# Altium project PH.PrjPcb
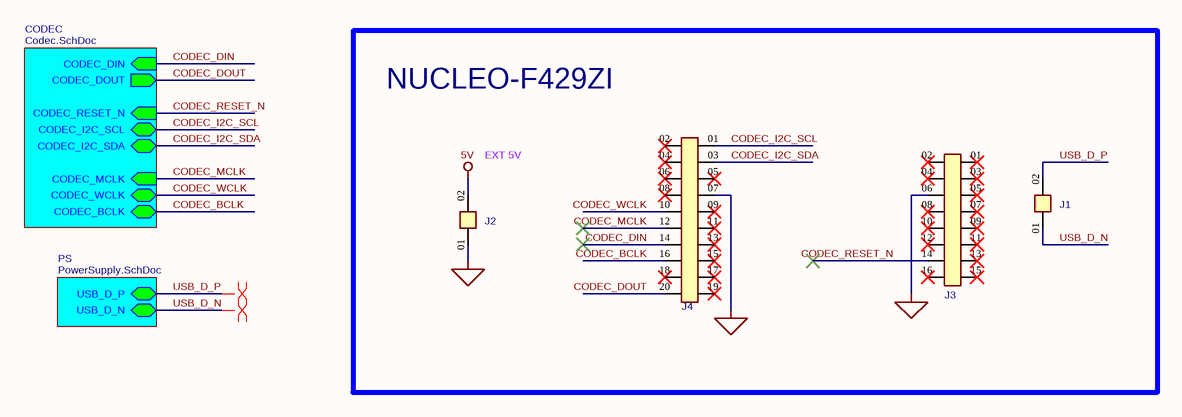
[diagram p0: AudioLab.SchDoc]
3 sheets, 115 parts. Net scope: hierarchical (ports join the sheet entries above them; power ports are global).
Board file: AudioLab.PcbDoc
Sheets:
  AudioLab.SchDoc
    CODEC = Codec.SchDoc
    PS = PowerSupply.SchDoc

## Sheet AudioLab.SchDoc: audiolab
size A3; Author: Martín Ramírez Espinosa; Revision: 1.0; SheetNumber: 1; SheetTotal: 3

### Parts
J1  HTSW-102-07-G-S  [SAMTEC_HTSW-102-XX-X-S]  (value not drawn)
J2  HTSW-102-07-G-S  [SAMTEC_HTSW-102-XX-X-S]  (value not drawn)
J3  TSW-108-07-G-D  [SAMTEC_TSW-108-07-G-D]  (value not drawn)
J4  TSW-110-07-G-D  [SAMTEC_TSW-110-07-G-D]  (value not drawn)

### Sub-sheets
CODEC = Codec.SchDoc: CODEC_BCLK (bidir), CODEC_WCLK (bidir), CODEC_MCLK (in), CODEC_I2C_SDA (bidir), CODEC_I2C_SCL (bidir), CODEC_RESET_N (in), CODEC_DIN (in), CODEC_DOUT (out)
PS = PowerSupply.SchDoc: USB_D_P (bidir), USB_D_N (bidir)

### Nets
5V: J2.02
GND: J2.01 J3.06 J4.07
CODEC_BCLK: J4.16 ; sheet CODEC/CODEC_BCLK
CODEC_DIN: J4.14 ; sheet CODEC/CODEC_DIN
CODEC_DOUT: J4.20 ; sheet CODEC/CODEC_DOUT
CODEC_I2C_SCL: J4.01 ; sheet CODEC/CODEC_I2C_SCL
CODEC_I2C_SDA: J4.03 ; sheet CODEC/CODEC_I2C_SDA
CODEC_MCLK: J4.12 ; sheet CODEC/CODEC_MCLK
CODEC_RESET_N: J3.14 ; sheet CODEC/CODEC_RESET_N
CODEC_WCLK: J4.10 ; sheet CODEC/CODEC_WCLK
USB_D_N: J1.01 ; sheet PS/USB_D_N
USB_D_P: J1.02 ; sheet PS/USB_D_P

Not connected (* = marked no-connect by the designer): J3 01* 02* 03* 04* 05* 07* 08* 09* 10* 11* 12* 13* 15* 16*; J4 02* 04* 05* 06* 08* 09* 11* 13* 15* 17* 18* 19*

### Layout directives
differential pair: USB_D_N, USB_D_P

### Notes on the sheet
- NUCLEO-F429ZI
- (near J2) EXT 5V

### Library data of the parts
J1 J2 = HTSW-102-07-G-S: Pin Header, Vertical, Board-to-Board, 2.54 mm, 1 Rows, 2 Contacts, Through Hole, HTSW; Manufacturer: Samtec Inc.; Value: *; Manufacturer Part Number: HTSW-102-07-G-S; Supplier Part Number: SAM8736-ND; Supplier: DigiKey; Package/Case: Bag
J3 = TSW-108-07-G-D: Pin Header, Unshrouded, Board-to-Board, 2.54 mm, 2 Rows, 16 Contacts, Through Hole, TSW; Manufacturer: Samtec Inc.; Value: *; Manufacturer Part Number: TSW-108-07-G-D; Supplier Part Number: SAM1028-08-ND; Supplier: DigiKey; Package/Case: Bulk
J4 = TSW-110-07-G-D: Pin Header, Vertical, Board-to-Board, 2.54 mm, 2 Rows, 20 Contacts, Through Hole, HTSW Series; Manufacturer: Samtec Inc.; Supplier: DigiKey; Supplier Part Number: SAM1028-10-ND; Manufacturer Part Number: TSW-110-07-G-D; Value: *; Package/Case: Bulk

## Sheet Codec.SchDoc: codec
size A3; Author: Martín Ramírez Espinosa; Revision: 1.0; SheetNumber: 2; SheetTotal: 3
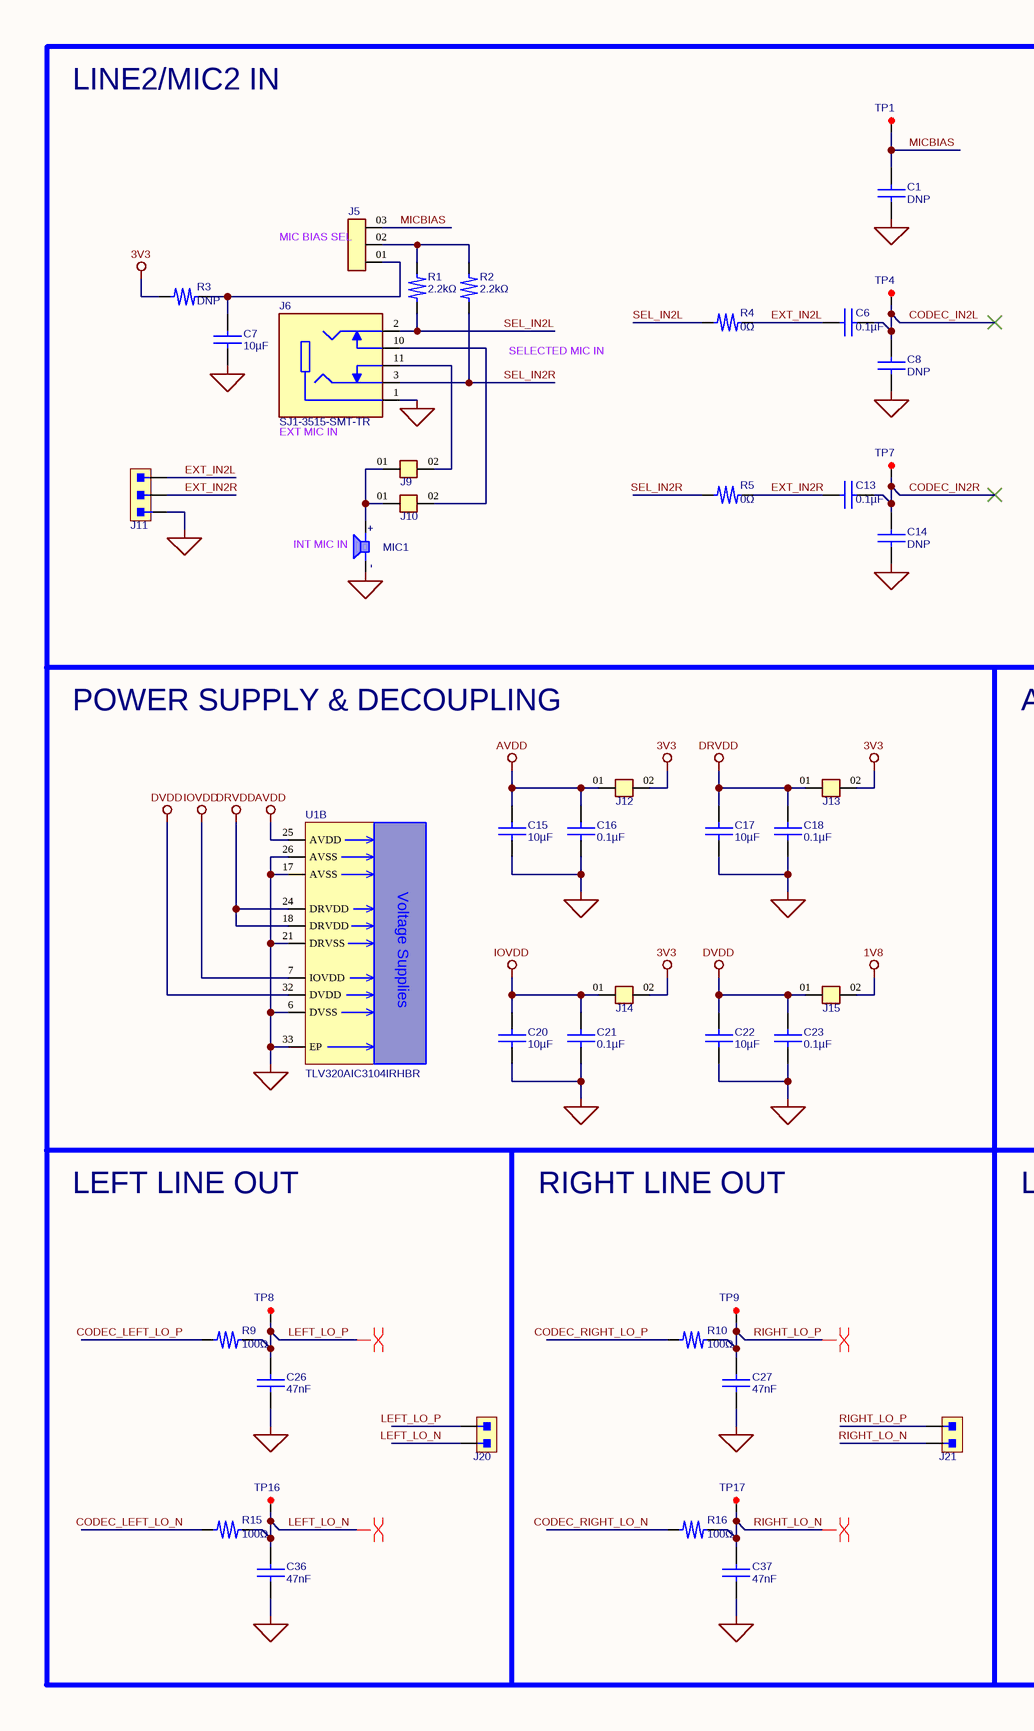
[diagram p1: Codec.SchDoc, left]
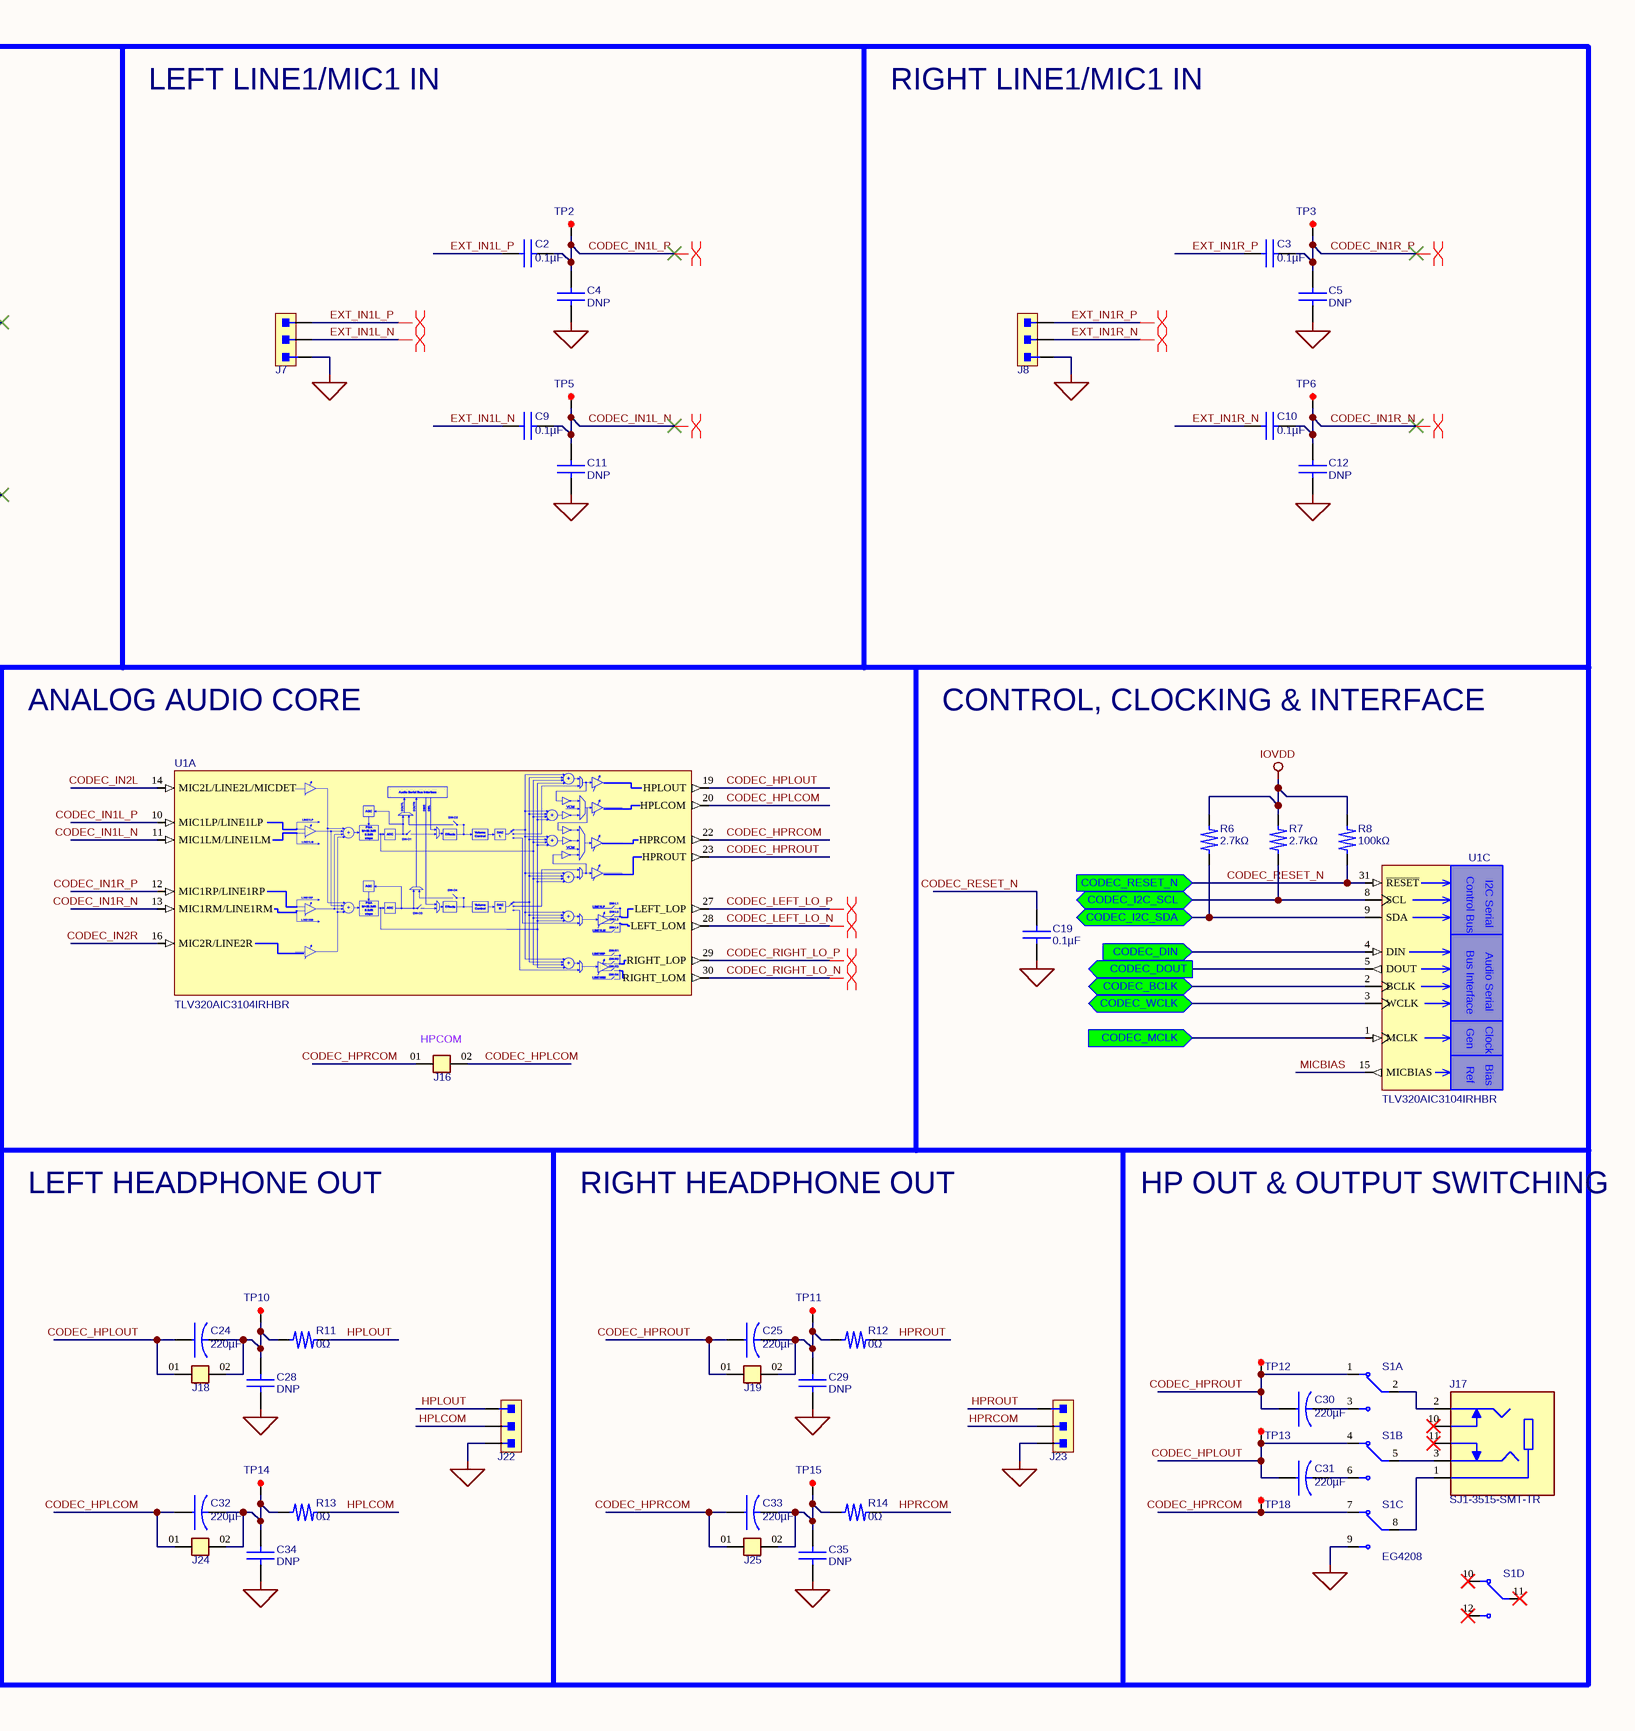
[diagram p2: Codec.SchDoc, right]

### Parts
C1  value DNP  [CAPC3216]  (hidden comment: DNP_1206)  (no BOM)
C2  value 0.1µF  [CAPC3216]  (hidden comment: C3216X7R2A104K160AA)
C3  value 0.1µF  [CAPC3216]  (hidden comment: C3216X7R2A104K160AA)
C4  value DNP  [CAPC3216]  (hidden comment: DNP_1206)  (no BOM)
C5  value DNP  [CAPC3216]  (hidden comment: DNP_1206)  (no BOM)
C6  value 0.1µF  [CAPC3216]  (hidden comment: C3216X7R2A104K160AA)
C7  value 10µF  [CAPC3225]  (hidden comment: C3225X7R1H106K250AC)
C8  value DNP  [CAPC3216]  (hidden comment: DNP_1206)  (no BOM)
C9  value 0.1µF  [CAPC3216]  (hidden comment: C3216X7R2A104K160AA)
C10  value 0.1µF  [CAPC3216]  (hidden comment: C3216X7R2A104K160AA)
C11  value DNP  [CAPC3216]  (hidden comment: DNP_1206)  (no BOM)
C12  value DNP  [CAPC3216]  (hidden comment: DNP_1206)  (no BOM)
C13  value 0.1µF  [CAPC3216]  (hidden comment: C3216X7R2A104K160AA)
C14  value DNP  [CAPC3216]  (hidden comment: DNP_1206)  (no BOM)
C15  value 10µF  [CAPC3225]  (hidden comment: C3225X7R1H106K250AC)
C16  value 0.1µF  [CAPC1608]  (hidden comment: C0603G104K5RACT500)
C17  value 10µF  [CAPC3225]  (hidden comment: C3225X7R1H106K250AC)
C18  value 0.1µF  [CAPC1608]  (hidden comment: C0603G104K5RACT500)
C19  value 0.1µF  [CAPC1608]  (hidden comment: C0603G104K5RACT500)
C20  value 10µF  [CAPC3225]  (hidden comment: C3225X7R1H106K250AC)
C21  value 0.1µF  [CAPC1608]  (hidden comment: C0603G104K5RACT500)
C22  value 10µF  [CAPC3225]  (hidden comment: C3225X7R1H106K250AC)
C23  value 0.1µF  [CAPC1608]  (hidden comment: C0603G104K5RACT500)
C24  value 220µF  [CAPPRD500W60D800H1150]  (hidden comment: EEU-FR1E221B)
C25  value 220µF  [CAPPRD500W60D800H1150]  (hidden comment: EEU-FR1E221B)
C26  value 47nF  [CAPC1608]  (hidden comment: C1608X7R1H473K080AE)
C27  value 47nF  [CAPC1608]  (hidden comment: C1608X7R1H473K080AE)
C28  value DNP  [CAPC3216]  (hidden comment: DNP_1206)  (no BOM)
C29  value DNP  [CAPC3216]  (hidden comment: DNP_1206)  (no BOM)
C30  value 220µF  [CAPPRD500W60D800H1150]  (hidden comment: EEU-FR1E221B)
C31  value 220µF  [CAPPRD500W60D800H1150]  (hidden comment: EEU-FR1E221B)
C32  value 220µF  [CAPPRD500W60D800H1150]  (hidden comment: EEU-FR1E221B)
C33  value 220µF  [CAPPRD500W60D800H1150]  (hidden comment: EEU-FR1E221B)
C34  value DNP  [CAPC3216]  (hidden comment: DNP_1206)  (no BOM)
C35  value DNP  [CAPC3216]  (hidden comment: DNP_1206)  (no BOM)
C36  value 47nF  [CAPC1608]  (hidden comment: C1608X7R1H473K080AE)
C37  value 47nF  [CAPC1608]  (hidden comment: C1608X7R1H473K080AE)
J5  M20-9990346  [HARWIN_M20-9990346]  (value not drawn)
J6  SJ1-3515-SMT-TR  [SAMESKY_SJ1-3515-SMT]
J7  397730003  [MOLEX_0397730003]  (value not drawn)
J8  397730003  [MOLEX_0397730003]  (value not drawn)
J9  HTSW-102-07-G-S  [SAMTEC_HTSW-102-XX-X-S]  (value not drawn)
J10  HTSW-102-07-G-S  [SAMTEC_HTSW-102-XX-X-S]  (value not drawn)
J11  397730003  [MOLEX_0397730003]  (value not drawn)
J12  HTSW-102-07-G-S  [SAMTEC_HTSW-102-XX-X-S]  (value not drawn)
J13  HTSW-102-07-G-S  [SAMTEC_HTSW-102-XX-X-S]  (value not drawn)
J14  HTSW-102-07-G-S  [SAMTEC_HTSW-102-XX-X-S]  (value not drawn)
J15  HTSW-102-07-G-S  [SAMTEC_HTSW-102-XX-X-S]  (value not drawn)
J16  HTSW-102-07-G-S  [SAMTEC_HTSW-102-XX-X-S]  (value not drawn)
J17  SJ1-3515-SMT-TR  [SAMESKY_SJ1-3515-SMT]
J18  HTSW-102-07-G-S  [SAMTEC_HTSW-102-XX-X-S]  (value not drawn)
J19  HTSW-102-07-G-S  [SAMTEC_HTSW-102-XX-X-S]  (value not drawn)
J20  0397730002  [MOLEX_0397730002]  (value not drawn)
J21  0397730002  [MOLEX_0397730002]  (value not drawn)
J22  397730003  [MOLEX_0397730003]  (value not drawn)
J23  397730003  [MOLEX_0397730003]  (value not drawn)
J24  HTSW-102-07-G-S  [SAMTEC_HTSW-102-XX-X-S]  (value not drawn)
J25  HTSW-102-07-G-S  [SAMTEC_HTSW-102-XX-X-S]  (value not drawn)
MIC1  AOM-4544P-2-R  [MIC_PUIAUDIO_AOM-4544P-2-R]  (value not drawn)
R1  value 2.2kΩ  [RESC3216]  (hidden comment: ERJ-8GEYJ222V)
R2  value 2.2kΩ  [RESC3216]  (hidden comment: ERJ-8GEYJ222V)
R3  value DNP  [RESC3216]  (hidden comment: DNP_1206)  (no BOM)
R4  value 0Ω  [RESC3216]  (hidden comment: ERJ-8GEY0R00V)
R5  value 0Ω  [RESC3216]  (hidden comment: ERJ-8GEY0R00V)
R6  value 2.7kΩ  [RESC1608]  (hidden comment: ERJ-3GEYJ272V)
R7  value 2.7kΩ  [RESC1608]  (hidden comment: ERJ-3GEYJ272V)
R8  value 100kΩ  [RESC1608]  (hidden comment: RC0603FR-07100KL)
R9  value 100Ω  [RESC1608]  (hidden comment: RC0603FR-07100RL)
R10  value 100Ω  [RESC1608]  (hidden comment: RC0603FR-07100RL)
R11  value 0Ω  [RESC3216]  (hidden comment: ERJ-8GEY0R00V)
R12  value 0Ω  [RESC3216]  (hidden comment: ERJ-8GEY0R00V)
R13  value 0Ω  [RESC3216]  (hidden comment: ERJ-8GEY0R00V)
R14  value 0Ω  [RESC3216]  (hidden comment: ERJ-8GEY0R00V)
R15  value 100Ω  [RESC1608]  (hidden comment: RC0603FR-07100RL)
R16  value 100Ω  [RESC1608]  (hidden comment: RC0603FR-07100RL)
S1  EG4208  [SW_EG4208]  (value not drawn)  (parts A,B,C,D of 4)
TP1  5000  [KEYSTONE_5000]  (value not drawn)
TP2  5000  [KEYSTONE_5000]  (value not drawn)
TP3  5000  [KEYSTONE_5000]  (value not drawn)
TP4  5000  [KEYSTONE_5000]  (value not drawn)
TP5  5000  [KEYSTONE_5000]  (value not drawn)
TP6  5000  [KEYSTONE_5000]  (value not drawn)
TP7  5000  [KEYSTONE_5000]  (value not drawn)
TP8  5000  [KEYSTONE_5000]  (value not drawn)
TP9  5000  [KEYSTONE_5000]  (value not drawn)
TP10  5000  [KEYSTONE_5000]  (value not drawn)
TP11  5000  [KEYSTONE_5000]  (value not drawn)
TP12  5000  [KEYSTONE_5000]  (value not drawn)
TP13  5000  [KEYSTONE_5000]  (value not drawn)
TP14  5000  [KEYSTONE_5000]  (value not drawn)
TP15  5000  [KEYSTONE_5000]  (value not drawn)
TP16  5000  [KEYSTONE_5000]  (value not drawn)
TP17  5000  [KEYSTONE_5000]  (value not drawn)
TP18  5000  [KEYSTONE_5000]  (value not drawn)
U1  TLV320AIC3104IRHBR  [QFN50P500X500X100_HS-33N]  (parts A,B,C of 3)

### Ports
CODEC_BCLK (bidir, see AudioLab[3B]), CODEC_DIN (in, see AudioLab[3B]), CODEC_DOUT (out, see AudioLab[3B]), CODEC_I2C_SCL (bidir, see AudioLab[3B]), CODEC_I2C_SDA (bidir, see AudioLab[3B]), CODEC_MCLK (in, see AudioLab[3B]), CODEC_RESET_N (in, see AudioLab[3B]), CODEC_WCLK (bidir, see AudioLab[3B])

### Nets
1V8: J15.02
3V3: J12.02 J13.02 J14.02 R3.2
AVDD: C15.2 C16.1 J12.01 U1.25(AVDD)
DRVDD: C17.2 C18.1 J13.01 U1.18(DRVDD) U1.24(DRVDD)
DVDD: C22.2 C23.1 J15.01 U1.32(DVDD)
GND: C1.1 C4.1 C5.1 C7.1 C8.1 C11.1 C12.1 C14.1 C15.1 C16.2 C17.1 C18.2 C19.1 C20.1 C21.2 C22.1 C23.2 C26.2 C27.2 C28.1 C29.1 C34.1 C35.1 C36.2 C37.2 J6.1(sleeve) J7.3 J8.3 J11.3 J22.1 J23.1 MIC1.N S1.9 U1.6(DVSS) U1.17(AVSS) U1.21(DRVSS) U1.26(AVSS) U1.33(EP)
IOVDD: C20.2 C21.1 J14.01 R6.2 R7.2 R8.2 U1.7(IOVDD)
CODEC_BCLK: U1.2(BCLK) ; port CODEC_BCLK
CODEC_DIN: U1.4(DIN) ; port CODEC_DIN
CODEC_DOUT: U1.5(DOUT) ; port CODEC_DOUT
CODEC_HPLCOM: C32.P J16.02 J24.01 U1.20(HPLCOM)
CODEC_HPLOUT: C24.P C31.P J18.01 S1.4 TP13.TP U1.19(HPLOUT)
CODEC_HPRCOM: C33.P J16.01 J25.01 S1.7 TP18.TP U1.22(HPRCOM)
CODEC_HPROUT: C25.P C30.P J19.01 S1.1 TP12.TP U1.23(HPROUT)
CODEC_I2C_SCL: R7.1 U1.8(SCL) ; port CODEC_I2C_SCL
CODEC_I2C_SDA: R6.1 U1.9(SDA) ; port CODEC_I2C_SDA
CODEC_IN1L_N: C9.2 C11.2 TP5.TP U1.11(MIC1LM/LINE1LM)
CODEC_IN1L_P: C2.2 C4.2 TP2.TP U1.10(MIC1LP/LINE1LP)
CODEC_IN1R_N: C10.2 C12.2 TP6.TP U1.13(MIC1RM/LINE1RM)
CODEC_IN1R_P: C3.2 C5.2 TP3.TP U1.12(MIC1RP/LINE1RP)
CODEC_IN2L: C6.2 C8.2 TP4.TP U1.14(MIC2L/LINE2L/MICDET)
CODEC_IN2R: C13.2 C14.2 TP7.TP U1.16(MIC2R/LINE2R)
CODEC_LEFT_LO_N: R15.1 U1.28(LEFT_LOM)
CODEC_LEFT_LO_P: R9.1 U1.27(LEFT_LOP)
CODEC_MCLK: U1.1(MCLK) ; port CODEC_MCLK
CODEC_RESET_N: C19.2 R8.1 U1.31(~{RESET}) ; port CODEC_RESET_N
CODEC_RIGHT_LO_N: R16.1 U1.30(RIGHT_LOM)
CODEC_RIGHT_LO_P: R10.1 U1.29(RIGHT_LOP)
CODEC_WCLK: U1.3(WCLK) ; port CODEC_WCLK
EXT_IN1L_N: C9.1 J7.2
EXT_IN1L_P: C2.1 J7.1
EXT_IN1R_N: C10.1 J8.2
EXT_IN1R_P: C3.1 J8.1
EXT_IN2L: C6.1 J11.1 R4.2
EXT_IN2R: C13.1 J11.2 R5.2
HPLCOM: J22.2 R13.2
HPLOUT: J22.3 R11.2
HPRCOM: J23.2 R14.2
HPROUT: J23.3 R12.2
LEFT_LO_N: C36.1 J20.2 R15.2 TP16.TP
LEFT_LO_P: C26.1 J20.1 R9.2 TP8.TP
MICBIAS: C1.2 J5.03 TP1.TP U1.15(MICBIAS)
RIGHT_LO_N: C37.1 J21.2 R16.2 TP17.TP
RIGHT_LO_P: C27.1 J21.1 R10.2 TP9.TP
SEL_IN2L: J6.2(tip) R1.2 R4.1
SEL_IN2R: J6.3(ring) R2.2 R5.1
NetC7_2: C7.2 J5.01 R3.1
NetC24_N: C24.N C28.2 J18.02 R11.1 TP10.TP
NetC25_N: C25.N C29.2 J19.02 R12.1 TP11.TP
NetC30_N: C30.N S1.3
NetC31_N: C31.N S1.6
NetC32_N: C32.N C34.2 J24.02 R13.1 TP14.TP
NetC33_N: C33.N C35.2 J25.02 R14.1 TP15.TP
NetJ5_02: J5.02 R1.1 R2.1
NetJ6_10: J6.10(tip_switch) J10.02
NetJ6_11: J6.11(ring_switch) J9.02
NetJ9_01: J9.01 J10.01 MIC1.P
NetJ17_1: J17.1(sleeve) S1.8
NetJ17_2: J17.2(tip) S1.2
NetJ17_3: J17.3(ring) S1.5

Not connected (* = marked no-connect by the designer): J17 10(tip_switch)* 11(ring_switch)*; S1 10* 11* 12*

### Layout directives
differential pair: CODEC_IN1L_N, CODEC_IN1L_P, CODEC_IN1R_N, CODEC_IN1R_P, CODEC_LEFT_LO_N, CODEC_LEFT_LO_P, CODEC_RIGHT_LO_N, CODEC_RIGHT_LO_P, EXT_IN1L_N, EXT_IN1L_P, EXT_IN1R_N, EXT_IN1R_P, LEFT_LO_N, LEFT_LO_P, RIGHT_LO_N, RIGHT_LO_P

### Notes on the sheet
- LINE2/MIC2 IN
- LEFT LINE1/MIC1 IN
- RIGHT LINE1/MIC1 IN
- (near J5) MIC BIAS SEL
- (near R2) SELECTED MIC IN
- EXT MIC IN
- (near MIC1) INT MIC IN
- POWER SUPPLY & DECOUPLING
- ANALOG AUDIO CORE
- CONTROL, CLOCKING & INTERFACE
- (near J16) HPCOM
- LEFT LINE OUT
- RIGHT LINE OUT
- LEFT HEADPHONE OUT
- RIGHT HEADPHONE OUT
- HP OUT & OUTPUT SWITCHING
- (in symbol AOM-4544P-2-R) +; -
- (in symbol TLV320AIC3104IRHBR, part B) Voltage Supplies
- (in symbol TLV320AIC3104IRHBR, part C) Control Bus; I2C Serial; Bus Interface; Audio Serial; Gen; Clock; Ref; Bias

### Library data of the parts
C1 C4 C5 C8 C11 C12 C14 C28 C29 C34 C35 R3 = DNP_1206: Do Not Populate 1206 (3216 Metric)
C2 C3 C6 C9 C10 C13 = C3216X7R2A104K160AA: Multilayer Ceramic Capacitor, C Series, 0.1 - F, - 10%, X7R, 100 V, 1206 [3216 Metric]; Manufacturer: TDK; Supplier: DigiKey; Supplier Part Number: 445-1377-1-ND; Manufacturer Part Number: C3216X7R2A104K160AA; Package/Case: 1206 (3216 Metric)
C7 C15 C17 C20 C22 = C3225X7R1H106K250AC: Ceramic Capacitor, Multilayer, Ceramic, 50V, 10% +Tol, 10% -Tol, X7R, 15% TC, 10uF, Surface Mount, 1210; Manufacturer: TDK; Supplier: DigiKey; Supplier Part Number: 445-C3225X7R1H106K250ACCT-ND; Manufacturer Part Number: C3225X7R1H106K250AC; Package/Case: 1210 (3225 Metric)
C16 C18 C19 C21 C23 = C0603G104K5RACT500: 0603 (1608METRIC) Ceramic Capacitor SMD Indust X7R HT175C 50V 0.1MUF ±10% X7R; Manufacturer: KEMET; Supplier: DigiKey; Supplier Part Number: 399-13261-1-ND; Manufacturer Part Number: C0603G104K5RACT500; Package/Case: 0603 (1608 Metric)
C24 C25 C30-C33 = EEU-FR1E221B: Radial Can ALUMINUM ELECTROLYTIC CAPACITOR FR 25V 220muF ±20% 0.315Dia 8.00mm; Manufacturer: Panasonic; Supplier: DigiKey; Supplier Part Number: P124224TB-ND; Manufacturer Part Number: EEU-FR1E221B; Package/Case: Radial, Can
C26 C27 C36 C37 = C1608X7R1H473K080AE: 50V 47nF X7R 卤10% 0603 Multilayer Ceramic Capacitors MLCC - SMD/SMT ROHS; Manufacturer: TDK; Supplier: DigiKey; Supplier Part Number: 445-173621-1-ND; Manufacturer Part Number: C1608X7R1H473K080AE; Package/Case: 0603 (1608 Metric)
J5 = M20-9990346: M20 ROHS3Compliant COMMERCIAL UL Connector Header, Cuttable 50Cycles 30mOhm -40C~105C 3A; Manufacturer: Harwin Inc.; Value: *; Manufacturer Part Number: M20-9990346; Supplier: DigiKey; Supplier Part Number: 952-2264-ND; Package/Case: Bulk
J6 J17 = SJ1-3515-SMT-TR: 3.5 mm, Stereo, Right Angle, Surface Mount (SMT), Audio Jack Connector; Manufacturer: Same Sky (Formerly CUI Devices); Value: *; Supplier: DigiKey; Manufacturer Part Number: SJ1-3515-SMT-TR; Supplier Part Number: CP1-3515SJCT-ND; Package/Case: CT
J7 J8 J11 J22 J23 = 397730003: 2.54mm Pitch Beau Eurostyle Fixed Mount PCB Terminal Block, Green, 3 Circuits; Manufacturer: Molex; Manufacturer Part Number: 0397730003; Supplier: DigiKey; Supplier Part Number: 0397730003-ND; Package/Case: Bulk; Value: *
J9 J10 J12-J16 J18 J19 J24 J25 = HTSW-102-07-G-S: as J1 on sheet AudioLab; Value: *; Manufacturer Part Number: HTSW-102-07-G-S; Supplier Part Number: SAM8736-ND; Supplier: DigiKey; Package/Case: Bag
J20 J21 = 0397730002: 2.54mm Pitch Beau Eurostyle Fixed Mount PCB Terminal Block, Green, 2 Circuits; Manufacturer: Molex; Supplier: DigiKey; Supplier Part Number: 0397730002-ND; Manufacturer Part Number: 0397730002; Package/Case: Bulk; Value: *
MIC1 = AOM-4544P-2-R: 50 Hz ~ 16 kHz Analog Microphone Electret Condenser 1.5 V ~ 10 V Omnidirectional (-44dB ±2dB) PC Pins; Manufacturer: PUI Audio, Inc.; Value: *; Supplier: DigiKey; Supplier Part Number: 668-1197-ND; Manufacturer Part Number: AOM-4544P-2-R; Package/Case: Bulk
R1 R2 = ERJ-8GEYJ222V: Res Thick Film 1206 2.2K Ohm 5% 1/4W ±200ppm/°C Molded SMD Punched Carrier T/R; Manufacturer: Panasonic Industry; Supplier: DigiKey; Supplier Part Number: P2.2KECT-ND; Manufacturer Part Number: ERJ-8GEYJ222V; Package/Case: 1206 (3216 Metric)
R4 R5 R11-R14 = ERJ-8GEY0R00V: ERJ Series 1206 0 Ohm 0.25 W Jumper Surface Mount Thick Film Chip Resistor; Manufacturer: Panasonic Industry; Supplier: DigiKey; Supplier Part Number: P0.0ECT-ND; Manufacturer Part Number: ERJ-8GEY0R00V; Package/Case: 1206 (3216 Metric)
R6 R7 = ERJ-3GEYJ272V: Res Thick Film 0603 2.7K Ohm 5% 0.1W(1/10W) ±200ppm/C Pad SMD T/R Automotive AEC-Q200; Manufacturer: Panasonic Industry; Supplier: DigiKey; Supplier Part Number: P2.7KGCT-ND; Manufacturer Part Number: ERJ-3GEYJ272V; Package/Case: 0603 (1608 Metric)
R8 = RC0603FR-07100KL: Res General Purpose Thick Film 0603 100k Ohm 1% 1/10W ±100ppm/°C Molded Paper T/R; Manufacturer: Yageo Group; Supplier: DigiKey; Supplier Part Number: 311-100KHRCT-ND; Manufacturer Part Number: RC0603FR-07100KL; Package/Case: 0603 (1608 Metric)
R9 R10 R15 R16 = RC0603FR-07100RL: Res Thick Film 0603 100 Ohm 1% 1/10W ±100ppm/°C Molded SMD Paper T/R; Manufacturer: Yageo Group; Supplier: DigiKey; Supplier Part Number: 311-100HRCT-ND; Manufacturer Part Number: RC0603FR-07100RL; Package/Case: 0603 (1608 Metric)
S1 = EG4208: Slide Switch, EG Series, 4PDT, ON-ON, 4mm Actuator, 200mA DC, 30VDC, R/A PC | E-Switch EG4208; Value: *; Manufacturer Part Number: EG4208; Manufacturer: E-Switch; Supplier Part Number: EG1914-ND; Supplier: DigiKey; Package/Case: Bulk
TP1-TP18 = 5000: Test Point Miniature THM H .300 Nylon 46 Insulated Red PhosBronze/Silver | Keystone Electronics 5000; Supplier: DigiKey; Supplier Part Number: 36-5000-ND; Value: *; Manufacturer Part Number: 5000; Manufacturer: Keystone Electronics; Package/Case: Bulk
U1 = TLV320AIC3104IRHBR: Low-Power Stereo CODEC with 6 Inputs, 6 Outputs, HP Amp and Enhanced Digital Effects; Manufacturer: Texas Instruments; Value: *; Supplier Part Number: 296-26818-1-ND; Supplier: DigiKey; Manufacturer Part Number: TLV320AIC3104IRHBR; Package/Case: 32-VFQFN Exposed Pad

## Sheet PowerSupply.SchDoc: PowerSupply
size A3; Author: Martín Ramírez Espinosa; Revision: 1.0; SheetNumber: 3; SheetTotal: 3
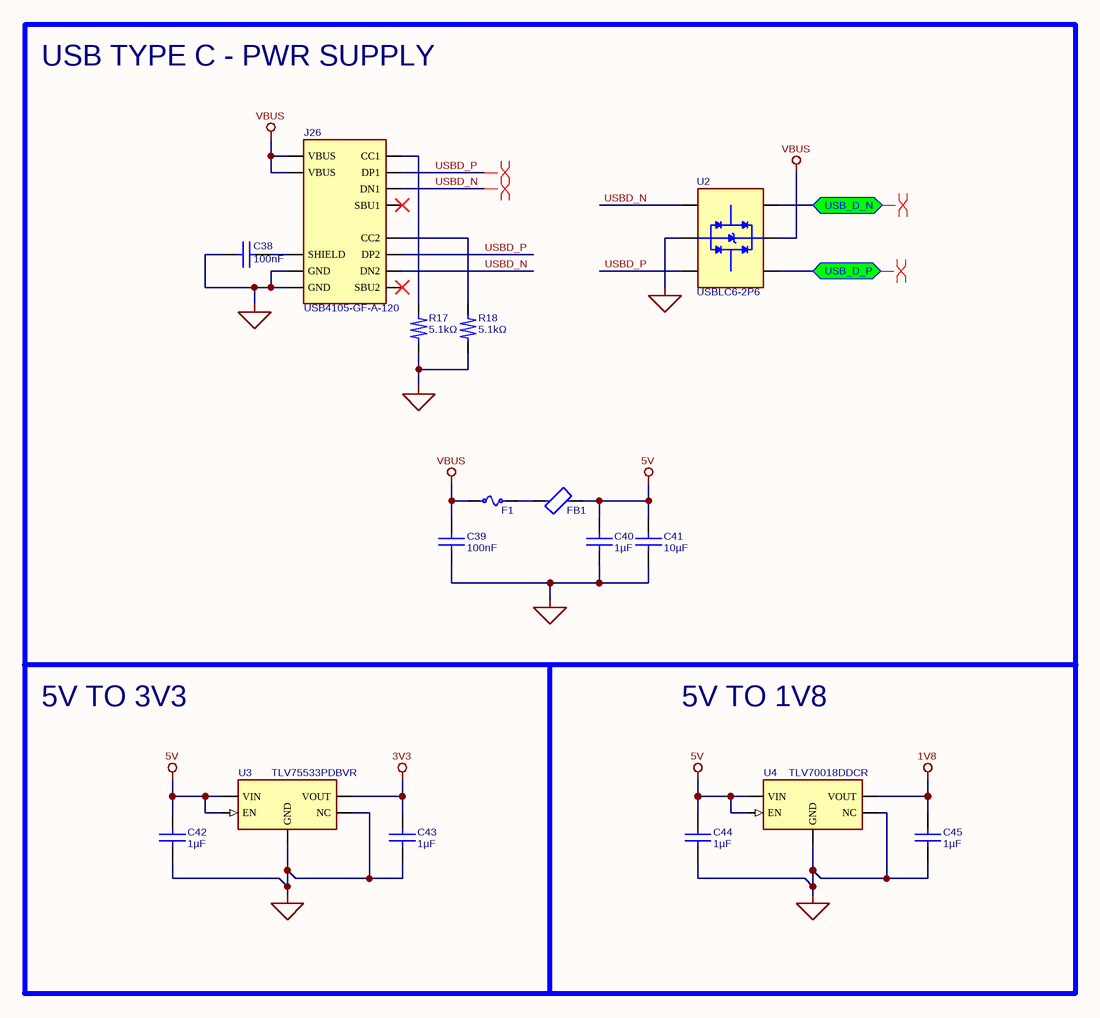
[diagram p3: PowerSupply.SchDoc]

### Parts
C38  value 100nF  [CAPC2012]  (hidden comment: CC0805KRX7R9BB104)
C39  value 100nF  [CAPC2012]  (hidden comment: CC0805KRX7R9BB104)
C40  value 1µF  [CAPC2012]  (hidden comment: CL21B105KBFNNNE)
C41  value 10µF  [CAPC3216]  (hidden comment: C3216X5R1C106K160AA)
C42  value 1µF  [CAPC2012]  (hidden comment: CL21B105KBFNNNE)
C43  value 1µF  [CAPC2012]  (hidden comment: CL21B105KBFNNNE)
C44  value 1µF  [CAPC2012]  (hidden comment: CL21B105KBFNNNE)
C45  value 1µF  [CAPC2012]  (hidden comment: CL21B105KBFNNNE)
F1  0467002.NR  [FUSC1608X31N]  (value not drawn)
FB1  BLM21PG221SN1D  [FP-BLM21-0_2-t0_85-e0_5-MFG]  (value not drawn)
J26  USB4105-GF-A-120  [GCT_USB4105-GF-A-120]
R17  value 5.1kΩ  [RESC1608]  (hidden comment: RC0603FR-075K1L)
R18  value 5.1kΩ  [RESC1608]  (hidden comment: RC0603FR-075K1L)
U2  USBLC6-2P6  [SOT50P160X60-6N]
U3  TLV75533PDBVR  [SOT95P280X110-5N]
U4  TLV70018DDCR  [SOT95P280X110-5N]

### Ports
USB_D_N (bidir, see AudioLab[3C]), USB_D_P (bidir, see AudioLab[3C])

### Nets
1V8: C45.1 U4.5(VOUT)
3V3: C43.1 U3.5(VOUT)
5V: C40.1 C41.1 C42.1 C44.1 FB1.2 U3.1(VIN) U3.3(EN) U4.1(VIN) U4.3(EN)
GND: C38.1 C39.1 C40.2 C41.2 C42.2 C43.2 C44.2 C45.2 J26.A1_B12(GND) J26.B1_A12(GND) R17.1 R18.1 U2.2(GND) U3.2(GND) U3.4(NC) U4.2(GND) U4.4(NC)
VBUS: C39.2 F1.2 J26.A4_B9(VBUS) J26.B4_A9(VBUS) U2.5(VBUS)
USB_D_N: U2.6(I/O1_2) ; port USB_D_N
USB_D_P: U2.4(I/O2_2) ; port USB_D_P
USBD_N: J26.A7(DN1) J26.B7(DN2) U2.1(I/O1_1)
USBD_P: J26.A6(DP1) J26.B6(DP2) U2.3(I/O2_1)
NetC38_2: C38.2 J26.SH(SHIELD)
NetF1_1: F1.1 FB1.1
NetJ26_A5: J26.A5(CC1) R17.2
NetJ26_B5: J26.B5(CC2) R18.2

Not connected (* = marked no-connect by the designer): J26 A8(SBU1)* B8(SBU2)*

### Layout directives
differential pair: USB_D_N, USB_D_P, USBD_N, USBD_P

### Notes on the sheet
- USB TYPE C - PWR SUPPLY
- 5V TO 3V3
- 5V TO 1V8

### Library data of the parts
C38 C39 = CC0805KRX7R9BB104: 50V 100nF X7R ±10% 0805 Multilayer Ceramic Capacitors MLCC - SMD/SMT ROHS; Manufacturer: YAGEO; Supplier: DigiKey; Supplier Part Number: 311-1140-1-ND; Manufacturer Part Number: CC0805KRX7R9BB104; Package/Case: 0805 (2012 Metric)
C40 C42-C45 = CL21B105KBFNNNE: 50V 1uF X7R ±10% 0805 Multilayer Ceramic Capacitors MLCC - SMD/SMT ROHS; Manufacturer: Samsung Electro-Mechanics; Supplier: DigiKey; Supplier Part Number: 1276-1029-1-ND; Manufacturer Part Number: CL21B105KBFNNNE; Package/Case: 0805 (2012 Metric)
C41 = C3216X5R1C106K160AA: Multilayer Ceramic Capacitors MLCC – SMD/SMT; TDK; C3216X5R1C106K160AA; 10 µF; 1206; 16 V; 16 V; Supplier: DigiKey; Supplier Part Number: 445-4052-1-ND; Manufacturer: TDK; Manufacturer Part Number: C3216X5R1C106K160AA; Package/Case: 1206 (3216 Metric)
F1 = 0467002.NR: Electric Fuse, Very Fast Blow, 2A, 32VAC, 32VDC, 35A (IR), Surface Mount, 0603; Manufacturer: Littelfuse Inc; Supplier: DigiKey; Supplier Part Number: F1397CT-ND; Manufacturer Part Number: 0467002.NR; Package/Case: 0603 (1608 Metric); Value: *
FB1 = BLM21PG221SN1D: 220 Ohms @ 100 MHz 1 Power Line Ferrite Bead 0805 (2012 Metric) 2A 45mOhm; Manufacturer: Murata Electronics; Value: *; Supplier: DigiKey; Supplier Part Number: 490-1054-1-ND; Manufacturer Part Number: BLM21PG221SN1D; Package/Case: 0805 (2012 Metric)
J26 = USB4105-GF-A-120: USB Connector, 24 Contact(s), Female, Right Angle, Solder Terminal, Locking, Receptacle; Manufacturer: GCT; Value: *; Manufacturer Part Number: USB4105-GF-A-120; Supplier: DigiKey; Supplier Part Number: 2073-USB4105-GF-A-120CT-ND; Package/Case: CT
R17 R18 = RC0603FR-075K1L: Res Thick Film 0603 5.1K Ohm 1% 0.1W(1/10W) ±100ppm/C Pad SMD T/R; Manufacturer: YAGEO; Supplier: DigiKey; Supplier Part Number: 311-5.10KHRCT-ND; Manufacturer Part Number: RC0603FR-075K1L; Package/Case: 0603 (1608 Metric)
U2 = USBLC6-2P6: Tvs Diodes & Esd Suppressors; USBLC6-2P6; Stmicroelectronics; 5 V; 17 V; 6 V; 6 V; Value: *; Manufacturer Part Number: USBLC6-2P6; Manufacturer: STMicroelectronics; Supplier Part Number: 497-5026-1-ND; Supplier: DigiKey; Package/Case: SOT-666
U3 = TLV75533PDBVR: 500mA high-PSRR low-IQ low-dropout voltage regulator with enable 5-SOT-23 -40 to 125; Manufacturer: Texas Instruments; Value: *; Supplier: DigiKey; Supplier Part Number: 296-50411-1-ND; Manufacturer Part Number: TLV75533PDBVR; Package/Case: SOT-23-5
U4 = TLV70018DDCR: 200-mA, high-PSRR, low-IQ, low-dropout voltage regulator with enable 5-SOT-23-THIN -40 to 125; Manufacturer: Texas Instruments; Value: *; Manufacturer Part Number: TLV70018DDCR; Supplier Part Number: 296-32410-1-ND; Supplier: DigiKey; Package/Case: SOT-23-5

## Nets that join several sheets
1V8: Codec (J15.02), PowerSupply (C45.1 U4.5)
3V3: Codec (J12.02 J13.02 J14.02 R3.2), PowerSupply (C43.1 U3.5)
5V: AudioLab (J2.02), PowerSupply (9 pins)
GND: AudioLab (J2.01 J3.06 J4.07), Codec (38 pins), PowerSupply (17 pins)
CODEC_BCLK: AudioLab (J4.16), Codec (U1.2)
CODEC_DIN: AudioLab (J4.14), Codec (U1.4)
CODEC_DOUT: AudioLab (J4.20), Codec (U1.5)
CODEC_I2C_SCL: AudioLab (J4.01), Codec (R7.1 U1.8)
CODEC_I2C_SDA: AudioLab (J4.03), Codec (R6.1 U1.9)
CODEC_MCLK: AudioLab (J4.12), Codec (U1.1)
CODEC_RESET_N: AudioLab (J3.14), Codec (C19.2 R8.1 U1.31)
CODEC_WCLK: AudioLab (J4.10), Codec (U1.3)
USB_D_N: AudioLab (J1.01), PowerSupply (U2.6)
USB_D_P: AudioLab (J1.02), PowerSupply (U2.4)